# EAGLE design buskoppler (EAGLE 5.11)

## Sheet 1 of 2
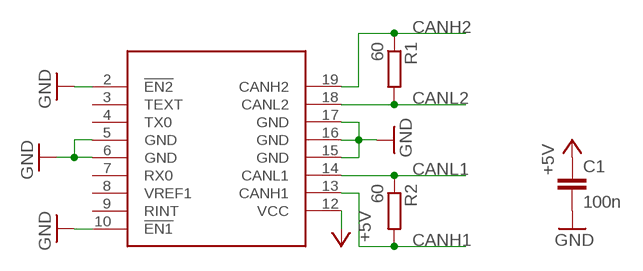
[diagram p0: schematic, sheet 1]

### Parts
C1  100n  C-EUC0805  [C0805]
R1  60  R-EU_R0805  [R0805]
R2  60  R-EU_R0805  [R0805]
U$1  AMIS-42700  [SO20W]

### Nets
+5V: C1.1 U$1.12(VCC) ; also sheet 2
CANH1: R2.2 U$1.13(CANH1) ; also sheet 2
CANH2: R1.1 U$1.19(CANH2) ; also sheet 2
CANL1: R2.1 U$1.14(CANL1) ; also sheet 2
CANL2: R1.2 U$1.18(CANL2) ; also sheet 2
GND: C1.2 U$1.2(!EN2) U$1.5(GND) U$1.6(GND) U$1.10(!EN1) U$1.15(GND) U$1.16(GND) U$1.17(GND) ; also sheet 2
Unconnected: U$1.3(TEXT) U$1.4(TX0) U$1.7(RX0) U$1.8(VREF1) U$1.9(RINT)

## Sheet 2 of 2
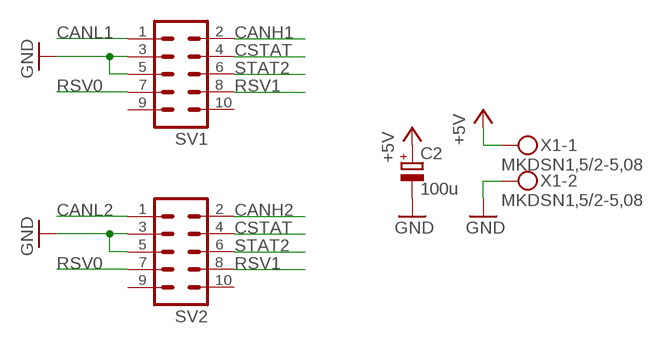
[diagram p1: schematic, sheet 2]

### Parts
C2  100u  CPOL-EUE2.5-6  [E2,5-6]
SV1  MA05-2  [MA05-2]
SV2  MA05-2  [MA05-2]
X1  MKDSN1,5/2-5,08  [MKDSN1,5/2-5,08]

### Nets
+5V: C2.+ X1.1 ; also sheet 1
CANH1: SV1.2 ; also sheet 1
CANH2: SV2.2 ; also sheet 1
CANL1: SV1.1 ; also sheet 1
CANL2: SV2.1 ; also sheet 1
CSTAT: SV1.4 SV2.4
GND: C2.- SV1.3 SV1.5 SV2.3 SV2.5 X1.2 ; also sheet 1
RSV0: SV1.7 SV2.7
RSV1: SV1.8 SV2.8
STAT2: SV1.6 SV2.6
Unconnected: SV1.9 SV1.10 SV2.9 SV2.10

## Library data of the parts
C1 = rcl:C-EU: CAPACITOR, European symbol
C2 = rcl:CPOL-EU: POLARIZED CAPACITOR, European symbol
R1 R2 = rcl:R-EU_: RESISTOR, European symbol
SV1 SV2 = con-lstb:MA05-2: PIN HEADER; OC_FARNELL: unknown; OC_NEWARK: unknown
U$1 = AMIS-42700:AMIS-42700
X1 = con-phoenix-508:MKDSN1,5/2-5,08: MKDSN 1,5/ 2-5,08 Printklemme Nennstrom: 13,5 A Nennspannung: 250 V Rastermaß: 5,08 mm Polzahl: 2 Anschlussart: Schraubanschluss Montage: Löten Anschlussrichtung Leiter/Platine: 0 ° Artikelnummer: 1729128 Source: http://eshop.phoenixcontact.com .. 1729128.pdf; MPN: MKDSN 1,5/2-5.08; OC_FARNELL: 1792903; OC_NEWARK: 30M2397

## Board
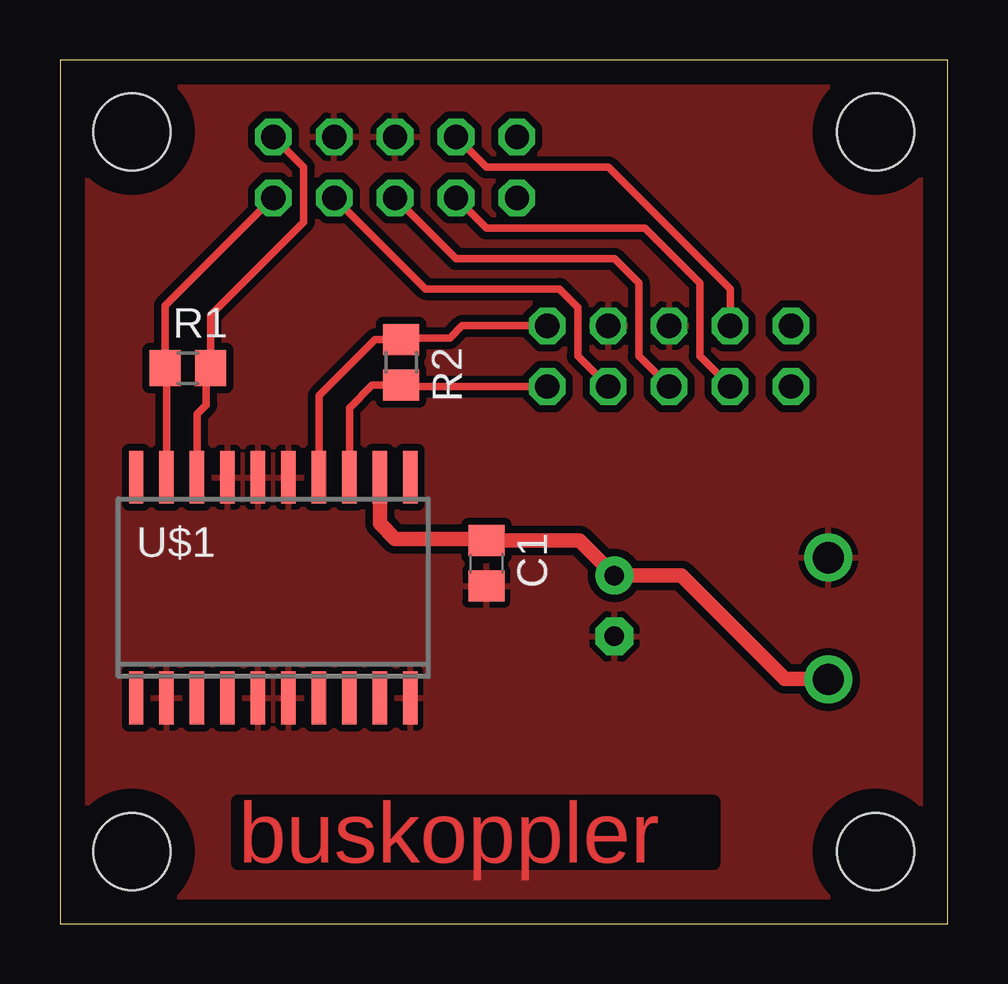
[diagram p2: board, top side]
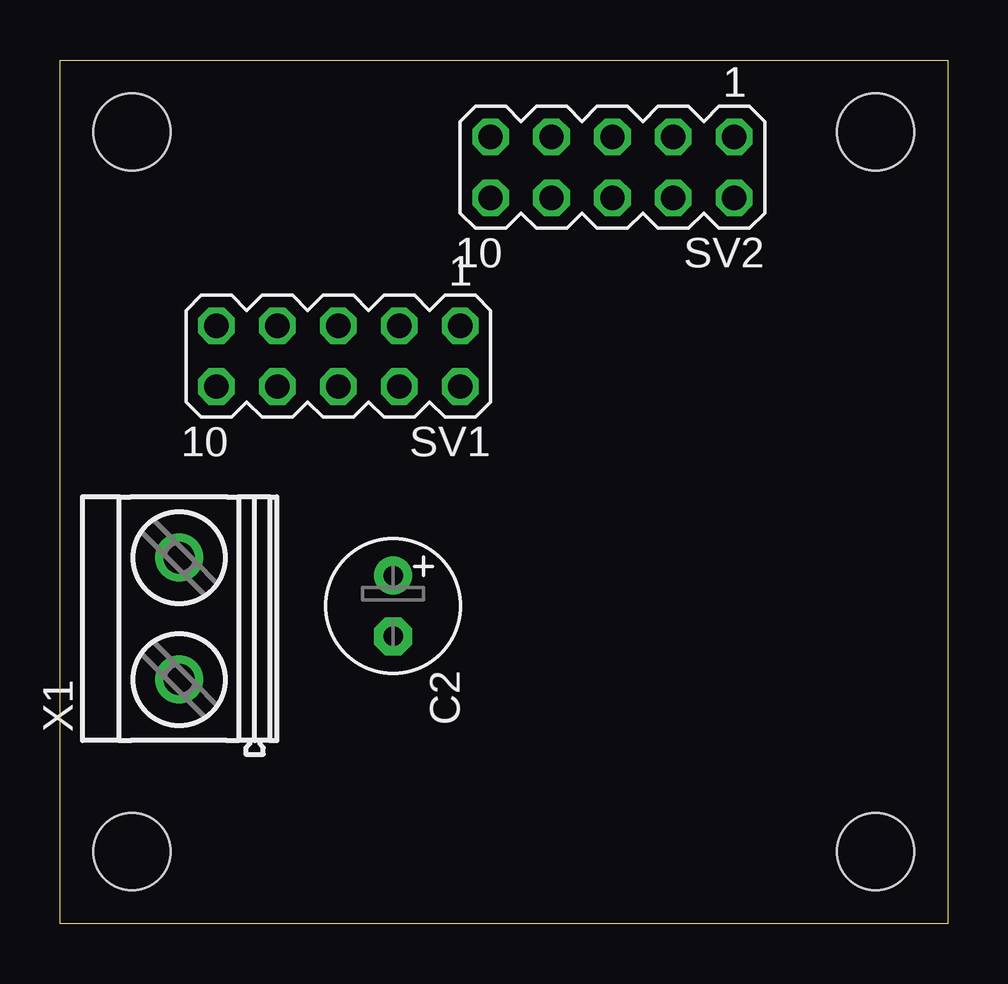
[diagram p3: board, bottom side, seen from below]

Size 37 x 36 mm. Coordinates in mm from the lower left corner, seen from the top.
Outline: 0,0 37,0 37,36 0,36 0,0
Copper layers (1*16): Top 0.035mm / dielectric 1.5mm / Bottom 0.035mm
Design rules "default *": minimum track width 8mil, minimum drill 24mil, track to track 8mil, track to pad 8mil, pad to pad 8mil, via to via 8mil, smd to smd 8mil, copper to edge 40mil, drill to drill 8mil, minimum pad ring 10mil, minimum via ring 8mil, stop-mask expansion 4mil, vias tented up to drill 0mil, thermal gap 10mil
Holes 3.2 mm at 3,3 34,3 3,33 34,33

### Footprints (pad centres in the part's own frame; a part is rotated, then mirrored left to right if it is on the bottom)
C0805 = smd 1.3 x 1.5: 1 -0.95,0; 2 0.95,0
E2,5-6 = drill 0.813 pad 1.6 round: + -1.27,0 | drill 0.813 pad 1.6 octagon: - 1.27,0
R0805 = smd 1.3 x 1.5: 1 -0.95,0; 2 0.95,0
MA05-2 = drill 1.016 octagon: 1 -5.08,-1.27; 2 -5.08,1.27; 3 -2.54,-1.27; 4 -2.54,1.27; 5 0,-1.27; 6 0,1.27; 7 2.54,-1.27; 8 2.54,1.27; 9 5.08,-1.27; 10 5.08,1.27
SO20W = smd 0.6 x 2.2: 1 -5.715,-4.6; 2 -4.445,-4.6; 3 -3.175,-4.6; 4 -1.905,-4.6; 5 -0.635,-4.6; 6 0.635,-4.6; 7 1.905,-4.6; 8 3.175,-4.6; 9 4.445,-4.6; 10 5.715,-4.6; 11 5.715,4.6; 12 4.445,4.6; 13 3.175,4.6; 14 1.905,4.6; 15 0.635,4.6; 16 -0.635,4.6; 17 -1.905,4.6; 18 -3.175,4.6; 19 -4.445,4.6; 20 -5.715,4.6
MKDSN1,5/2-5,08 = drill 1.3 pad 2 round: 1 -2.561,0.025; 2 2.519,0.025

### Placement (x,y rotation side)
C1  17.78,15.02 270 top
C2  23.11,13.24 270 bottom
R1  5.33,23.15 0 top
R2  14.22,23.4 270 top
SV1  25.4,23.65 180 bottom
SV2  13.97,31.53 180 bottom
U$1  8.89,14 0 top
X1  32,12.73 90 bottom

### Tracks (layer width: path | path; a pad name or v marks a point on that pad's centre or on a via)
+5V
  Top 0.61: U$1.12 13.34,16.67 13.97,16.03 17.71,16.03 C1.1 21.66,15.97 C2.+ 25.91,14.51 30.23,10.19 32.01,10.19 X1.1
CANH1
  Top 0.305: U$1.13 12.06,21.5 13.02,22.45 R2.2 14.29,22.38 SV1.2
CANH2
  Top 0.305: U$1.19 4.45,23.09 R1.1 4.38,25.75 SV2.2
CANL1
  Top 0.305: U$1.14 10.79,22 13.14,24.35 R2.1 14.29,24.42 16.26,24.42 16.76,24.92 SV1.1
CANL2
  Top 0.305: SV2.1 10.16,31.53 10.16,29.24 6.28,25.37 R1.2 6.1,22.96 6.1,21.62 5.71,21.24 U$1.18
CSTAT
  Top 0.305: SV2.4 15.24,26.45 20.83,26.45 21.59,25.69 21.59,23.65 SV1.4
GND
  pour Top (isolate 0.305): -1.27,37.64 38.64,37.64 38.64,-0.73 -1.27,-0.73
RSV0
  Top 0.305: SV2.7 17.78,31.53 22.86,31.53 27.94,26.45 SV1.7
RSV1
  Top 0.305: SV2.8 17.78,28.99 24.38,28.99 26.67,26.7 26.67,23.65 SV1.8
STAT2
  Top 0.305: SV2.6 16.51,27.72 23.11,27.72 24.13,26.7 24.13,23.65 SV1.6

### Text on the board
Top: buskoppler